# Altium project MicroFM.PrjPCB
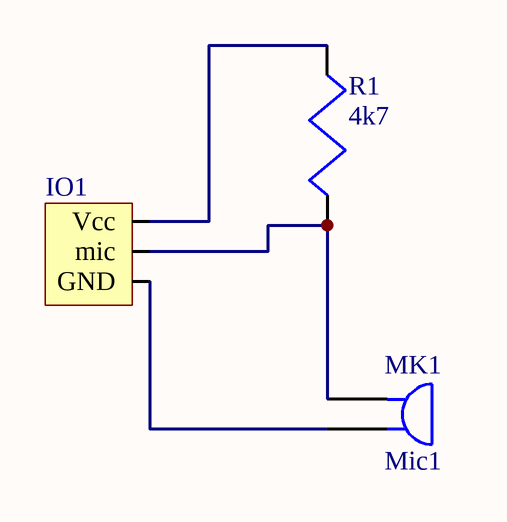
[diagram p0: MicroFM.SchDoc]
1 sheet, 3 parts. Net scope: global (net labels, ports and power ports of the same name join across sheets).
Board files: Micro.PcbDoc, Micro2.PcbDoc

## Sheet MicroFM.SchDoc
size A4

### Parts
IO1  MicroIO  [MicroIO3x1]  (value not drawn)
MK1  Mic1  [Mic1]
R1  4k7  [proto-resistor]

### Nets
NetIO1_0: IO1.0(Vcc) R1.1
NetIO1_1: IO1.1(mic) MK1.1 R1.2
NetIO1_2: IO1.2(GND) MK1.2

### Library data of the parts
MK1 = Mic1: Microphone; Published: 24-Mar-1999; LatestRevisionDate: 17-Jul-2002; LatestRevisionNote: Re-released for DXP Platform.; Publisher: Altium Limited
R1 = proto-resistor: Resistencia con conector de prototipado; Fabricante: ?; Modelo: ?; Proveedor: ?; Valor: ?